# Altium schematic sheet p06_sound.SchDoc
size A
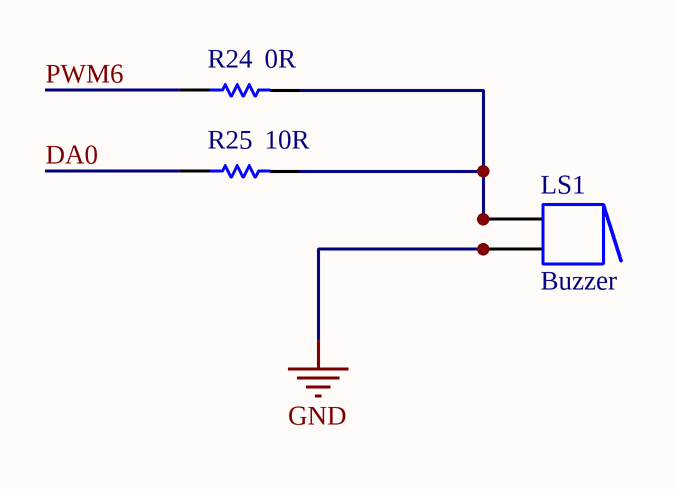
[diagram p0: p06_sound.SchDoc]

## Parts
LS1  Buzzer  [HDR1X2]
R24  value 0R  [6-0805_M]  (hidden comment: Res1)
R25  value 10R  [6-0805_M]  (hidden comment: Res1)

## Nets
GND: LS1.2 LS1.2A
DA0: R25.1
PWM6: R24.1
NetLS1_1: LS1.1 LS1.1A R24.2 R25.2

## Library data of the parts
LS1 = Buzzer: Magnetic Transducer Buzzer; Published: 24-Mar-1999; LatestRevisionDate: 17-Dec-2003; LatestRevisionNote: Schematic revised, PCB Footprint replaced.; DatasheetVersion: 17-Dec-2003; PackageReference: ABSM-1574; Publisher: Altium Limited; PackageDescription: Magnetic Transducer Buzzer; ComponentLink1Description: Manufacturer Link; ComponentLink1URL: http://www.megastar.com/linecard/buzzmode/index.php
R24 R25 = Res1: Resistor; Published: 8-Jun-2000; LatestRevisionDate: 17-Jul-2002; LatestRevisionNote: Re-released for DXP Platform.; PackageReference: AXIAL-0.3; Publisher: Altium Limited; PackageDescription: Axial Device, Thru-Hole; 2 Leads; 0.3 in Pin Spacing